# Altium schematic sheet Barrier_Schematic.SchDoc: Barrier Prj.
size A4; CompanyName: Pasargad-Barrier_Prj; Engineer: Pouya_Mn; Revision: 2
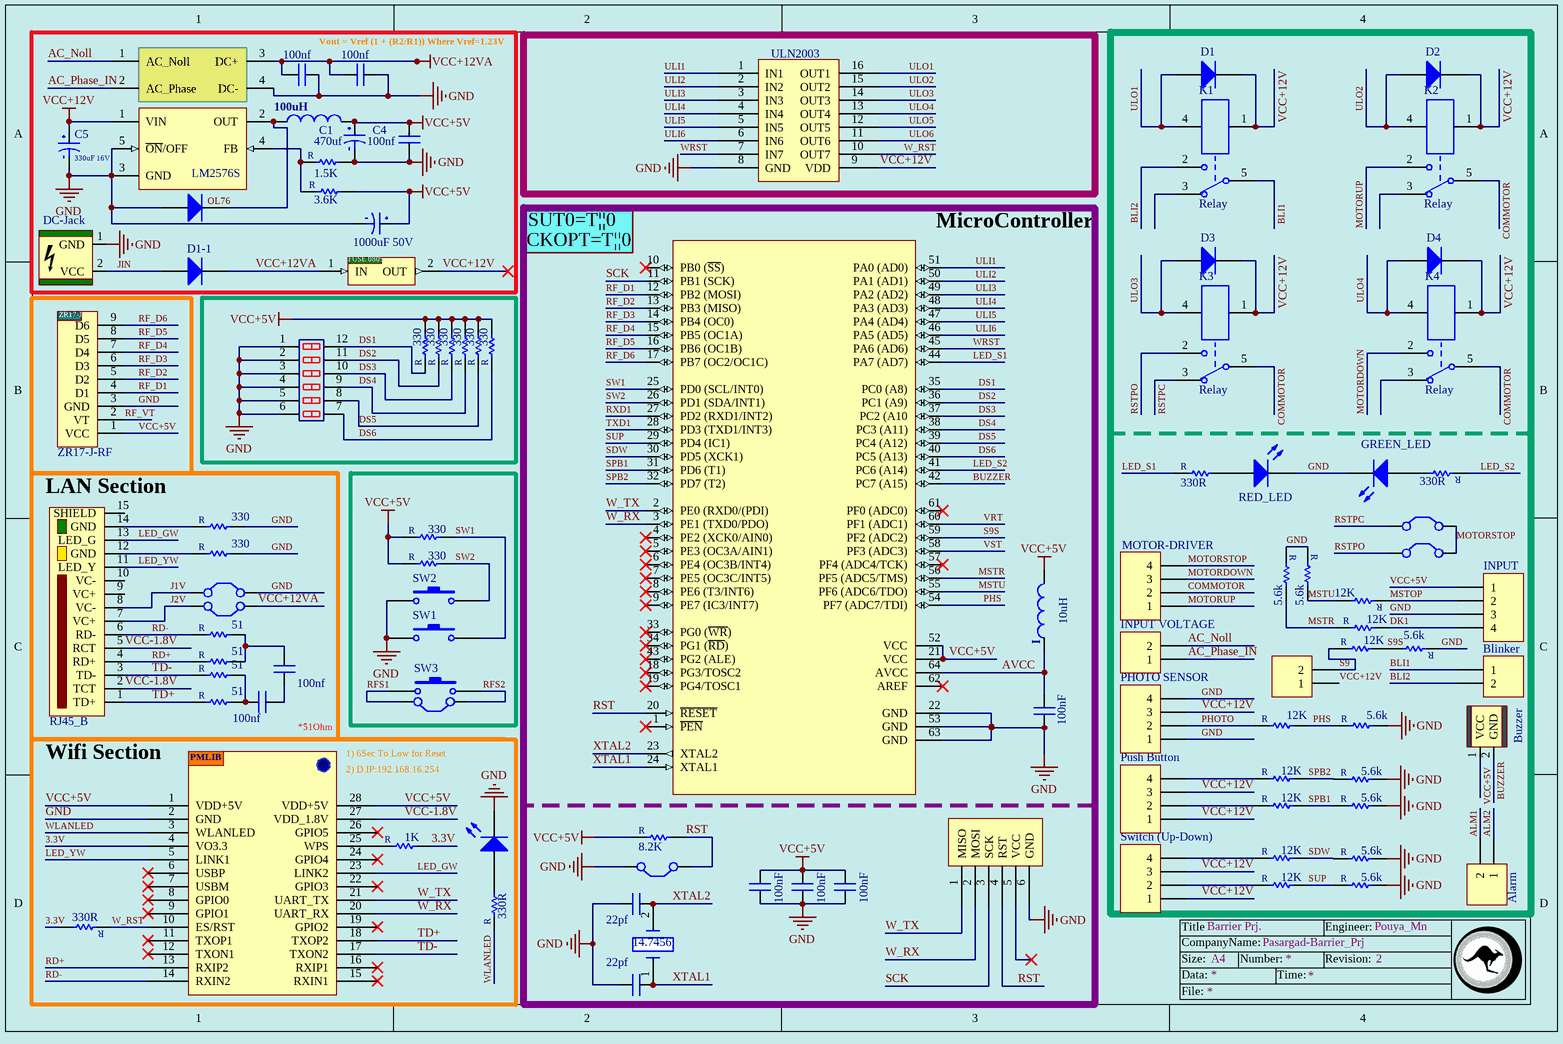
[diagram p0: Barrier_Schematic.SchDoc]

## Parts
3  HLK_WifiModule  [HLK]  (value not drawn)
7  10uH  [Indicator0805]
11  8.2K  [R0805]
15  Programmer  [Programmer]  (value not drawn)
17  330R  [R0805]
19  330R  [R0805]
34  330  [R0805]
35  330R  [R0805]
43  330  [R0805]
58  ZR17-J-RF  [ZR17-J]
78A  fuse_SMD0805  [fuse_SMD0805]  (value not drawn)
89  RJ45_B  [RJ45_B]
852  LM2576S  [LM2576S]
2323  Jumper  [Jumper]  (value not drawn)
?  t  [DIPSW6]  (value not drawn)
ACtoDC  ACtoDC  [Phonix-4]  (value not drawn)
B  Buzzer  [Buzzer]
C1  470uf  [2220]
C4  100nf  [Cap0805]
C5  Cap_4mm  [Cap_4mm]  (value not drawn)
C8  100nF  [Cap0805]
C9  22pf  [Cap0805]
C10  22pf  [Cap0805]
C12  100nf  [Cap0805]
C13  100nf  [Cap0805]
C18  Cap_5mm  [Cap_5mm]  (value not drawn)
C87  100nF  [Cap0805]
C88  100nF  [Cap0805]
C89  100nF  [Cap0805]
C93  100nf  [Cap0805]
C94  100nf  [Cap0805]
D1  (no value)  [Diod-1A-SMD]
D1-1  (no value)  [Diod-1A-SMD]
D1-2  (no value)  [Diod-1A-SMD]
D2  (no value)  [Diod-1A-SMD]
D3  (no value)  [Diod-1A-SMD]
D4  (no value)  [Diod-1A-SMD]
DSDF  DC-Jack  [DC_powerjack]
ER  330R  [R0805]
fdcg  Jumper  [Jumper]  (value not drawn)
fdcg3  Jumper  [Jumper]  (value not drawn)
fdcg3WW  Jumper  [Jumper]  (value not drawn)
fdcg30  Jumper  [Jumper]  (value not drawn)
fdcg38  Jumper  [Jumper]  (value not drawn)
G1  12K  [R0805]
G2  5.6k  [R0805]
G9  12K  [R0805]
G10  12K  [R0805]
G10u  12K  [R0805]
G12  5.6k  [R0805]
G12fg  5.6k  [R0805]
G13  5.6k  [R0805]
GJIK  ATX_1.2R  [ATX_1.2R]  (value not drawn)
GREEN_LED  LED_SMD  [Led0805]  (value not drawn)
H2  330  [R0805]
H3  330  [R0805]
H4  330  [R0805]
H5  330  [R0805]
H6  330  [R0805]
H7  330  [R0805]
H8  330  [R0805]
H9  12K  [R0805]
H10  330  [R0805]
H94  12K  [R0805]
H105  5.6k  [R0805]
H107  5.6k  [R0805]
I1-1  Indicator100uH  [Indicator_SMD]  (value not drawn)
INPUT  ATX2*2R  [ATX2*2R]  (value not drawn)
INPUT_VOLTAGE  Phonix  [Phonix-2]  (value not drawn)
K1  Relay  [Relay_2]
K2  Relay  [Relay_2]
K3  Relay  [Relay_2]
K4  Relay  [Relay_2]
PHOTO_SENSOR  ATX2*2R  [ATX2*2R]  (value not drawn)
PO  51  [R0805]
POS  51  [R0805]
POS2  51  [R0805]
POS3  51  [R0805]
POSWW  1K  [R0805]
Push_Button  ATX2*2R  [ATX2*2R]  (value not drawn)
R1-1-1  1.5K  [R0805]
R78  12K  [R0805]
R79  5.6k  [R0805]
R80  12K  [R0805]
R81  5.6k  [R0805]
R-1-1-2  3.6K  [R0805]
RED_LED  LED_SMD  [Led0805]  (value not drawn)
SW1  PushButton_small  [PushButton]  (value not drawn)
SW2  PushButton_small  [PushButton]  (value not drawn)
SW3  PushButton_small  [PushButton]  (value not drawn)
Switch_(Up-Down)  ATX2*2R  [ATX2*2R]  (value not drawn)
T4  MOTOR-DRIVER  [Phonix-4]
T8  Alarm  [Phonix-2]
T8E  Blinker  [Phonix-2]
U1  ATmega64-16AU  [64A_N]  (value not drawn)
WLANLED  LED_SMD  [Led0805]  (value not drawn)
WR  ULN2003  [SO16]
Y  14.7456  [CrystallB]

## Blocks framed on the sheet
Vout = Vref (1 + (R2/R1)) Where Vref=1.23V: 78A 852 ACtoDC C1 C4 C5 C12 C13 C18 D1-1 D1-2 DSDF I1-1 R1-1-1 R-1-1-2
MicroController: 7 11 15 C8-C10 C87-C89 fdcg30 U1 Y
Wifi Section: 3 35 ER POSWW WLANLED

## Nets
GND: 3.2(GND) 15.6(GND) 34.1 43.1 58.3(GND) 852.3(GND) 852.5(~{ON}/OFF) ?.1 ?.2 ?.3 ?.4 ?.5 ?.6 ACtoDC.4(DC-) C1.1 C4.1 C5.1 C8.1 C9.2 C10.2 C12.1 C13.1 C18.1 C87.1 C88.1 C89.1 D1-2.A DSDF.1(GND) fdcg.2(C2) fdcg30.2(C2) G2.1 G12.2 G12fg.2 G13.2 GREEN_LED.K H105.1 H107.1 INPUT.3 PHOTO_SENSOR.1 PHOTO_SENSOR.4 R1-1-1.1 R79.1 R81.1 RED_LED.K SW1.1 SW2.1 U1.22(GND) U1.53(GND) U1.63(GND) WLANLED.K WR.8(GND)
VCC+5V: 3.1(VDD+5V) 3.28(VDD+5V) 7.2 11.2 58.1(VCC) B.1(VCC) C1.2 C4.2 C18.2 C87.2 C88.2 C89.2 H2.1 H3.1 H4.1 H5.1 H6.1 H7.2 H8.2 H10.1 I1-1.2 INPUT.1 R-1-1-2.1 U1.21(VCC) U1.52(VCC)
VCC+12V: 78A.2(OUT) 852.1(VIN) C5.2 D1.K D2.K D3.K D4.K GJIK.1 K1.1 K2.1 K3.1 K4.1 PHOTO_SENSOR.3 Push_Button.1 Push_Button.3 Switch_(Up-Down).1 Switch_(Up-Down).3 WR.9(VDD)
VCC+12VA: 78A.1(IN) 2323.1(C1) ACtoDC.3(DC+) C12.2 C13.2 D1-1.K
3.3V: 3.4(VO3.3) 35.1 POSWW.1
AC_Noll: ACtoDC.1(AC_Noll) INPUT_VOLTAGE.2
AC_Phase_IN: ACtoDC.2(AC_Phase) INPUT_VOLTAGE.1
ALM1: T8.2
ALM2: T8.1
AVCC: 7.1 C8.2 U1.64(AVCC)
BLI1: K1.5 T8E.1
BLI2: K1.2 T8E.2
BUZZER: B.2(GND) U1.42(PC7_(A15))
COMMOTOR: K2.5 K3.5 K4.5 T4.2
DK1: G10.1 INPUT.4
DS1: ?.12 H10.2 U1.35(PC0_(A8))
DS2: ?.11 H2.2 U1.36(PC1_(A9))
DS3: ?.10 H3.2 U1.37(PC2_(A10)
DS4: ?.9 H4.2 U1.38(PC3_(A11))
DS5: ?.8 H5.2 U1.39(PC4_(A12))
DS6: ?.7 H6.2 U1.40(PC5_(A13))
J1V: 89.8(VC-) fdcg.1(C1)
J2V: 89.7(VC+) 2323.2(C2)
JIN: D1-1.A DSDF.2(VCC)
LED_GW: 3.23(LINK2) 89.13(LED_G)
LED_S1: 17.2 U1.44(PA7_(AD7))
LED_S2: 19.2 U1.41(PC6_(A14))
LED_YW: 3.5(LINK1) 89.11(LED_Y)
MOTORDOWN: K4.2 T4.3
MOTORSTOP: fdcg3.2(C2) fdcg38.2(C2) T4.4
MOTORUP: K2.2 T4.1
MSTOP: G9.2 INPUT.2
MSTR: G10.2 G12.1 U1.56(PF5_(ADC5/TMS))
MSTU: G9.1 G13.1 U1.55(PF6_(ADC6/TDO))
PHOTO: G1.2 PHOTO_SENSOR.2
PHS: G1.1 G2.2 U1.54(PF7_(ADC7/TDI))
RD+: 3.13(RXIP2) 89.4(RD+) POS3.2
RD-: 3.14(RXIN2) 89.6(RD-) POS2.2
RF_D1: 58.4(D1) U1.12(PB2_(MOSI))
RF_D2: 58.5(D2) U1.13(PB3_(MISO))
RF_D3: 58.6(D3) U1.14(PB4_(OC0))
RF_D4: 58.7(D4) U1.15(PB5_(OC1A))
RF_D5: 58.8(D5) U1.16(PB6_(OC1B))
RF_D6: 58.9(D6) U1.17(PB7_(OC2/OC1C))
RF_VT: 58.2(VT)
RFS1: fdcg3WW.2(C2) SW3.1
RFS2: fdcg3WW.1(C1) SW3.2
RST: 11.1 15.4(RST) fdcg30.1(C1) U1.20(~{RESET})
RSTPC: fdcg3.1(C1) K3.3
RSTPO: fdcg38.1(C1) K3.2
RXD1: U1.27(PD2_(RXD1/INT2))
S9: G10u.2 GJIK.2
S9S: G10u.1 G12fg.1 U1.59(PF2_(ADC2))
SCK: 15.3(SCK) U1.11(PB1_(SCK))
SDW: H94.1 H107.2 U1.30(PD5_(XCK1))
SPB1: R78.1 R79.2 U1.31(PD6_(T1))
SPB2: R80.1 R81.2 U1.32(PD7_(T2))
SUP: H9.1 H105.2 U1.29(PD4_(IC1))
SW1: H7.1 SW1.2 U1.25(PD0_(SCL/INT0))
SW2: H8.1 SW2.2 U1.26(PD1_(SDA/INT1))
TD+: 3.18(TXOP2) 89.1(TD+) PO.2
TD-: 3.17(TXON2) 89.3(TD-) POS.2
TXD1: U1.28(PD3_(TXD1/INT3))
ULI1: U1.51(PA0_(AD0)) WR.1(IN1)
ULI2: U1.50(PA1_(AD1)) WR.2(IN2)
ULI3: U1.49(PA2_(AD2)) WR.3(IN3)
ULI4: U1.48(PA3_(AD3)) WR.4(IN4)
ULI5: U1.47(PA4_(AD4)) WR.5(IN5)
ULI6: U1.46(PA5_(AD5)) WR.6(IN6)
ULO1: D1.A K1.4 WR.16(OUT1)
ULO2: D2.A K2.4 WR.15(OUT2)
ULO3: D3.A K3.4 WR.14(OUT3)
ULO4: D4.A K4.4 WR.13(OUT4)
ULO5: WR.12(OUT5)
ULO6: WR.11(OUT6)
VCC-1.8V: 3.27(VDD_1.8V) 89.2(TCT) 89.5(RCT)
VRT: U1.60(PF1_(ADC1))
VST: U1.58(PF3_(ADC3))
W_RST: 3.10(ES/RST) 35.2 WR.10(OUT7)
W_RX: 3.20(UART_RX) 15.2(MOSI) U1.3(PE1_(TXD0/PDO))
W_TX: 3.21(UART_TX) 15.1(MISO) U1.2(PE0_(RXD0/(PDI))
WLANLED: 3.3(WLANLED) ER.2
WRST: U1.45(PA6_(AD6)) WR.7(IN7)
XTAL1: C10.1 U1.24(XTAL1) Y.1
XTAL2: C9.1 U1.23(XTAL2) Y.2
Net3_25: 3.25(WPS) POSWW.2
Net17_1: 17.1 RED_LED.A
Net19_1: 19.1 GREEN_LED.A
Net34_2: 34.2 89.14(GND)
Net43_2: 43.2 89.12(GND)
Net852_2: 852.2(OUT) D1-2.K I1-1.1
Net852_4: 852.4(FB) R1-1-1.2 R-1-1-2.2
NetC93_1: C93.1 C94.1
NetC93_2: C93.2 PO.1 POS.1
NetC94_2: C94.2 POS2.1 POS3.1
NetER_1: ER.1 WLANLED.A
NetH9_2: H9.2 Switch_(Up-Down).2
NetH94_2: H94.2 Switch_(Up-Down).4
NetPush_Button_2: Push_Button.2 R78.2
NetPush_Button_4: Push_Button.4 R80.2

Not connected (* = marked no-connect by the designer): 3 6(USBP)* 7(USBM)* 8(GPIO0)* 9(GPIO1)* 11(TXOP1)* 12(TXON1)* 15(RXIN1)* 16(RXIP1)* 19(GPIO2)* 22(GPIO3)* 24(GPIO4)* 26(GPIO5)*; 15 5(VCC)*; 89 9(VC+) 10(VC-) 15(SHIELD); K1 3; K2 3; K4 3; U1 1(~{PEN})* 4(PE2_(XCK0/AIN0))* 5(PE3_(OC3A/AIN1))* 6(PE4_(OC3B/INT4))* 7(PE5_(OC3C/INT5))* 8(PE6_(T3/INT6))* 9(PE7_(IC3/INT7))* 10(PB0_(~{SS}))* 18(PG3/TOSC2)* 19(PG4/TOSC1)* 33(PG0_(~{WR}))* 34(PG1_(~{RD}))* 43(PG2_(ALE))* 57(PF4_(ADC4/TCK))* 61(PF0_(ADC0))* 62(AREF)*

## Notes on the sheet
- (near U1) CKOPT=T||0
- SUT0=T||0
- (near 89) LAN Section
- *51Ohm
- 1) 6Sec To Low for Reset
- (near 3) 2) D.IP:192.168.16.254
- Labels drawn without touching a wire or pin: OL76
- Title
- Size:
- Data:
- CompanyName:
- A4
- Number:
- Time:
- Revision:
- Engineer:
- File:
- (in symbol Cap_4mm) 330uF 16V
- (in symbol Cap_5mm) 1000uF 50V
- (in symbol fuse_SMD0805) FUSE 0805
- (in symbol HLK_WifiModule) PMLIB
- (in symbol Indicator100uH) 100uH
- (in symbol Indicator0805) I
- (in symbol R0805) R
- (in symbol ZR17-J-RF) ZR17-J

## Library data of the parts
7 = Indicator0805
11 17 19 34 35 43 ER G1 G2 G9 G10 G10u G12 G12fg G13 H2-H10 H94 H105 H107 PO POS POS2 POS3 POSWW R1-1-1 R78-R81 R-1-1-2 = R0805
? = DipSwitch6pin
C1 = Cap_4mm
C4 C8-C10 C12 C13 C87-C89 C93 C94 = Cap0805: surface mount capacitor (size 805)
D1 D1-1 D1-2 D2-D4 = Diode 1N4001 SMD
INPUT_VOLTAGE T8 T8E = Phonix-2
K1-K4 = Relay_2
T4 = Phonix-4
U1 = ATmega64-16AU: 8-bit AVR Microcontroller, 4.5-5.5V, 64KB Flash, 2KB EEPROM, 4KB SRAM, 64-pin TQFP, Industrial Grade (-40°C to 85°C), Pb-Free; DatasheetVersion: revQ, Jul-2010; PackageVersion: revC, Oct-2010; PackageReference: 64A; PackageDescription: 64-Pin Plastic Thin Profile Quad Flat Pack, 14 x 14 x 1.0 mm Body, 0.8 mm Pitch (TQFP); Code_JEDEC: MS-026-AEB; ComponentLink1Description: Manufacturer URL; ComponentLink1URL: http://www.atmel.com/; ComponentLink2Description: ATmega64(L)  Datasheet; ComponentLink2URL: http://www.atmel.com/dyn/resources/prod_documents/doc2490.pdf; ComponentLink3Description: ATmega64(L) Summary; ComponentLink3URL: http://www.atmel.com/dyn/resources/prod_documents/2490S.pdf
Y = Xtal 1